# EAGLE design switches annotated (EAGLE 6.5.0)
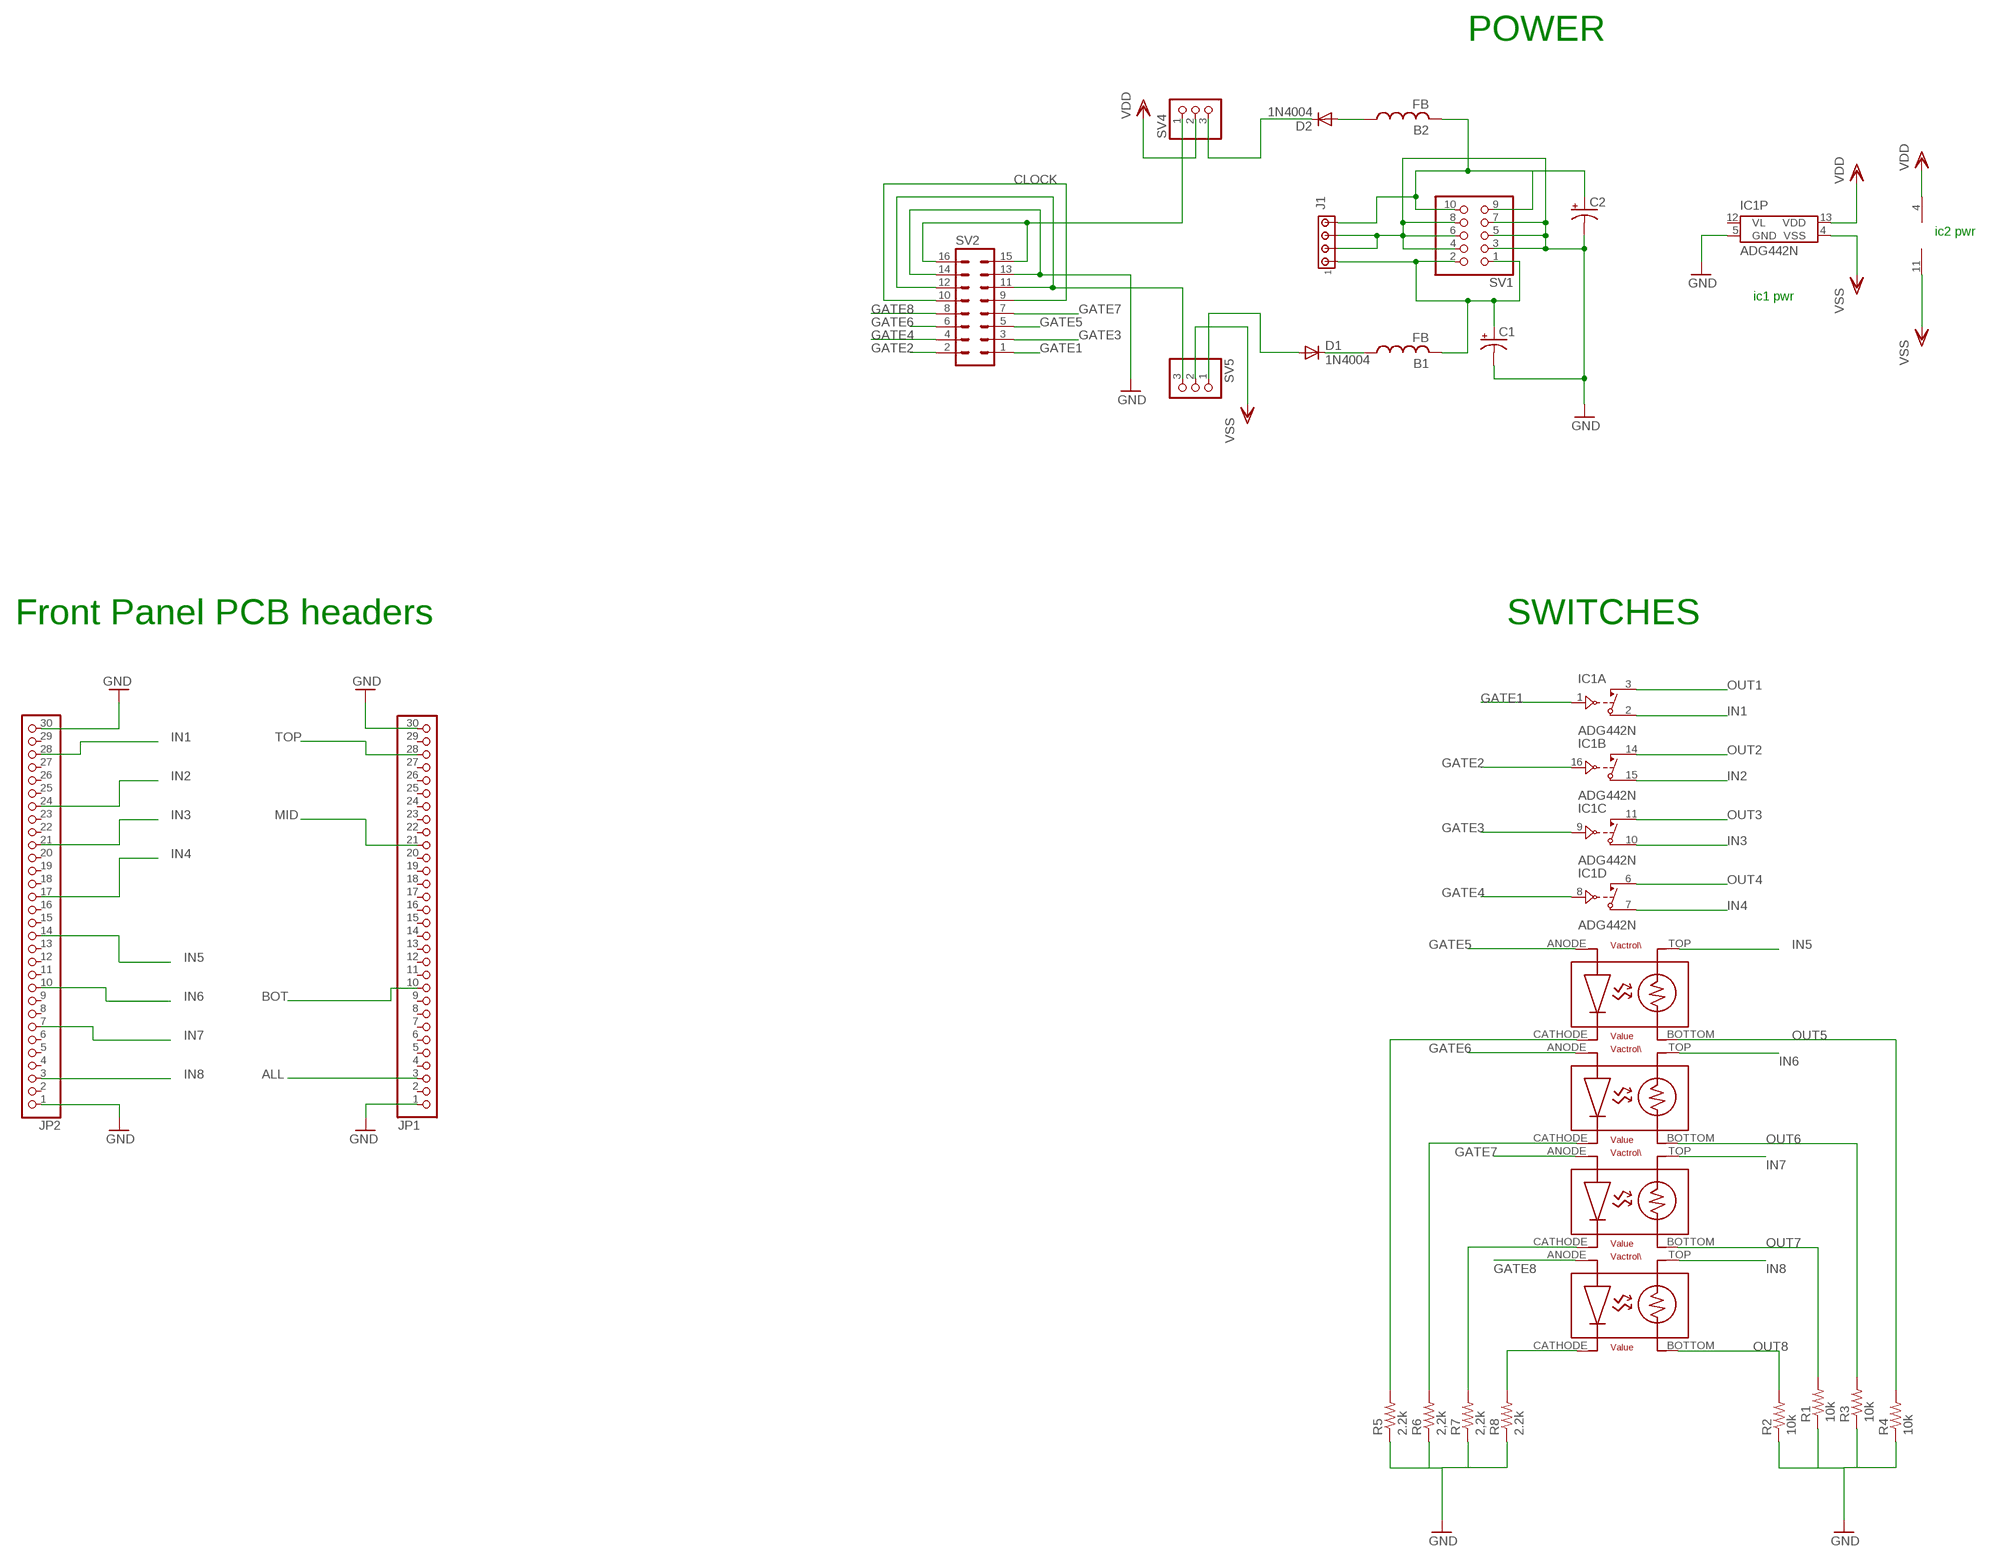
[diagram p0: schematic, sheet 1, part 1 of 2]
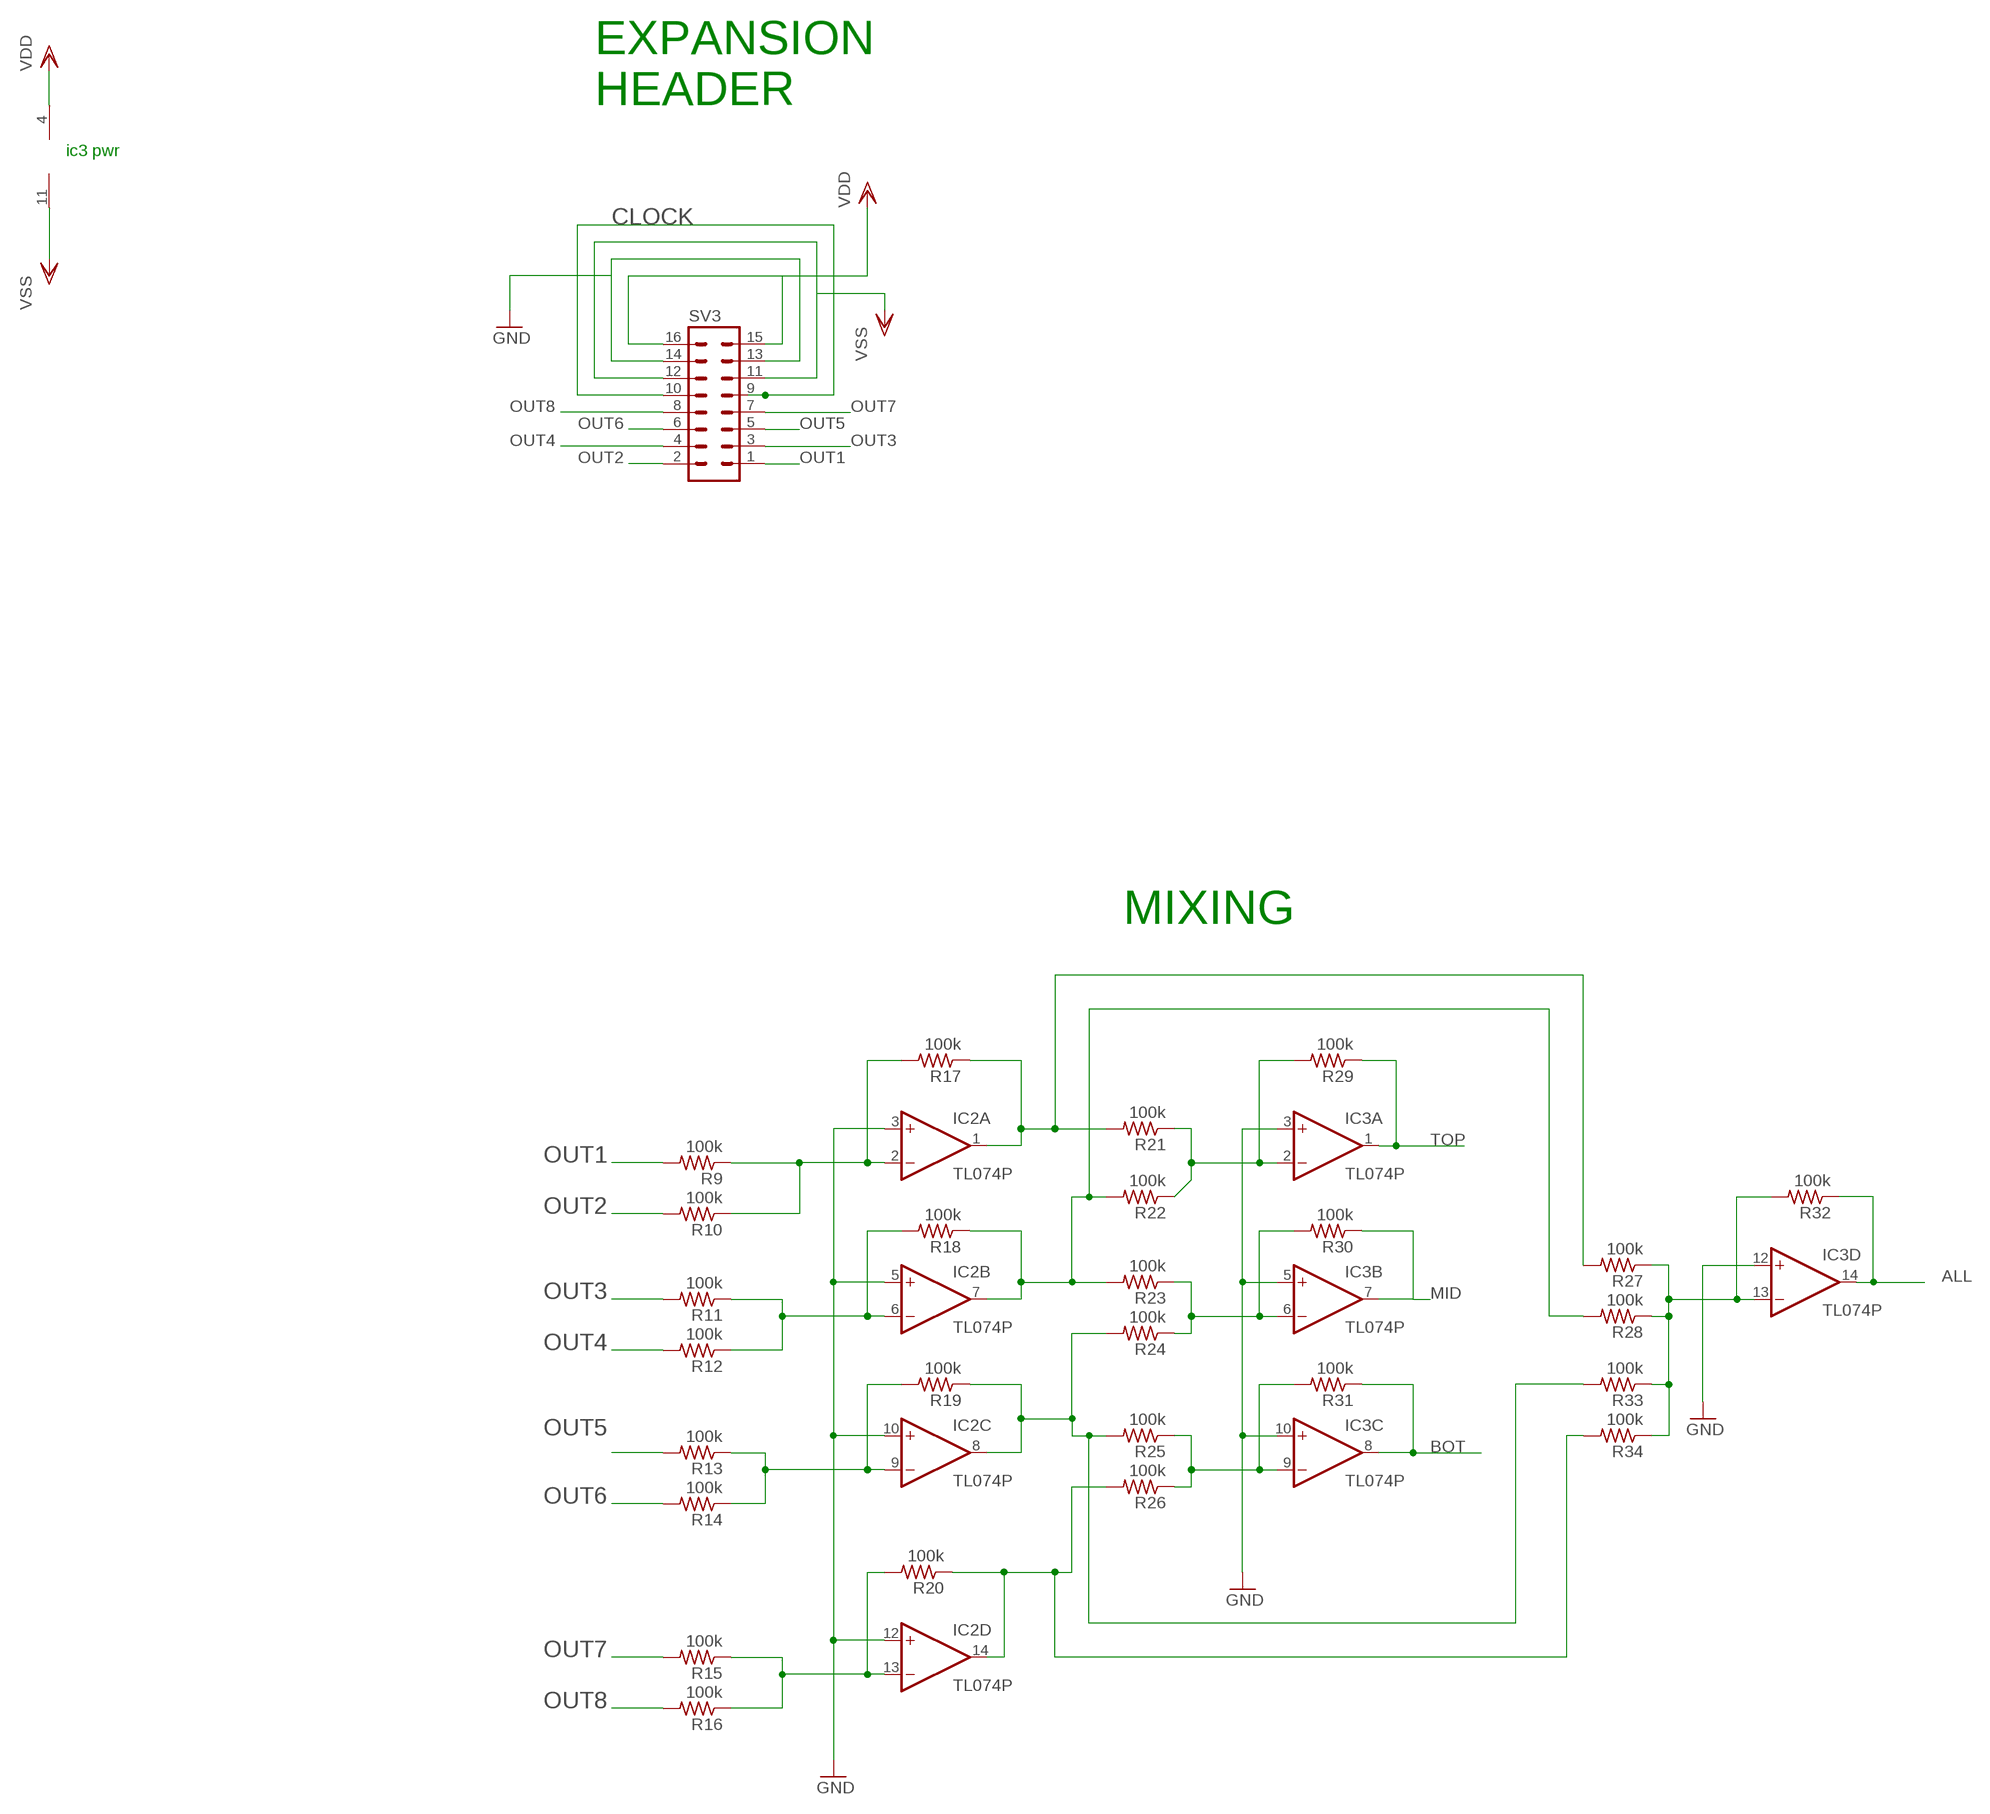
[diagram p1: schematic, sheet 1, part 2 of 2]

## Parts
B1  FB  [FB]
B2  FB  [FB]
C1  CPOL-USE1.8-4  [E1,8-4]
C2  CPOL-USE1.8-4  [E1,8-4]
D1  1N4004  [DO41-10]
D2  1N4004  [DO41-10]
IC1  ADG442N  [DIL16]
IC2  TL074P  [DIL14]
IC3  TL074P  [DIL14]
J1  MTA04-156  [1X4MTA]
JP1  PINHD-1X30  [1X30]
JP2  PINHD-1X30  [1X30]
R1  10k  R-US_0204/2V  [0204V]
R2  10k  R-US_0204/2V  [0204V]
R3  10k  R-US_0204/2V  [0204V]
R4  10k  R-US_0204/2V  [0204V]
R5  2.2k  R-US_0204/2V  [0204V]
R6  2,2k  R-US_0204/2V  [0204V]
R7  2,2k  R-US_0204/2V  [0204V]
R8  2.2k  R-US_0204/2V  [0204V]
R9  100k  R-US_0204/7  [0204/7]
R10  100k  R-US_0204/7  [0204/7]
R11  100k  R-US_0204/7  [0204/7]
R12  100k  R-US_0204/7  [0204/7]
R13  100k  R-US_0204/7  [0204/7]
R14  100k  R-US_0204/7  [0204/7]
R15  100k  R-US_0204/7  [0204/7]
R16  100k  R-US_0204/7  [0204/7]
R17  100k  R-US_0204/2V  [0204V]
R18  100k  R-US_0204/2V  [0204V]
R19  100k  R-US_0204/2V  [0204V]
R20  100k  R-US_0204/2V  [0204V]
R21  100k  R-US_0204/7  [0204/7]
R22  100k  R-US_0204/7  [0204/7]
R23  100k  R-US_0204/7  [0204/7]
R24  100k  R-US_0204/7  [0204/7]
R25  100k  R-US_0204/2V  [0204V]
R26  100k  R-US_0204/7  [0204/7]
R27  100k  R-US_0204/7  [0204/7]
R28  100k  R-US_0204/7  [0204/7]
R29  100k  R-US_0204/2V  [0204V]
R30  100k  R-US_0204/2V  [0204V]
R31  100k  R-US_0204/2V  [0204V]
R32  100k  R-US_0204/2V  [0204V]
R33  100k  R-US_0204/2V  [0204V]
R34  100k  R-US_0204/2V  [0204V]
SV1  PINHD-2X5  [2X05]
SV2  MA08-2  [MA08-2]
SV3  MA08-2  [MA08-2]
SV4  PINHD-1X3  [1X03]
SV5  PINHD-1X3  [1X03]
U$1  VACTROL  [VACTROL]
U$2  VACTROL  [VACTROL]
U$3  VACTROL  [VACTROL]
U$4  VACTROL  [VACTROL]

## Nets
ALL: IC3.14(D:OUT) JP1.3 R32.1
BOT: IC3.8(C:OUT) JP1.10 R31.1
CLOCK: SV2.9 SV2.10 SV3.9 SV3.10
GATE1: IC1.1(A:IN) SV2.1
GATE2: IC1.16(B:IN) SV2.2
GATE3: IC1.9(C:IN) SV2.3
GATE4: IC1.8(D:IN) SV2.4
GATE5: SV2.5 U$1.ANODE
GATE6: SV2.6 U$2.ANODE
GATE7: SV2.7 U$3.ANODE
GATE8: SV2.8 U$4.ANODE
GND: C1.- C2.- IC1.5(P:GND) IC2.3(A:+IN) IC2.5(B:+IN) IC2.10(C:+IN) IC2.12(D:+IN) IC3.3(A:+IN) IC3.5(B:+IN) IC3.10(C:+IN) IC3.12(D:+IN) J1.2 J1.3 JP1.1 JP1.30 JP2.1 JP2.30 R1.1 R2.1 R3.1 R4.1 R5.1 R6.1 R7.1 R8.1 SV1.3 SV1.4 SV1.5 SV1.6 SV1.7 SV1.8 SV2.13 SV2.14 SV3.13 SV3.14
IN1: IC1.2(A:D) JP2.28
IN2: IC1.15(B:D) JP2.24
IN3: IC1.10(C:D) JP2.21
IN4: IC1.7(D:D) JP2.17
IN5: JP2.14 U$1.TOP
IN6: JP2.10 U$2.TOP
IN7: JP2.7 U$3.TOP
IN8: JP2.3 U$4.TOP
MID: IC3.7(B:OUT) JP1.21 R30.1
N$1: R5.2 U$1.CATHODE
N$2: IC2.8(C:OUT) R19.1 R24.2 R25.2 R33.2
N$3: IC2.13(D:-IN) R15.1 R16.1 R20.2
N$4: IC2.14(D:OUT) R20.1 R26.2 R34.2
N$5: IC2.9(C:-IN) R13.1 R14.1 R19.2
N$6: IC2.6(B:-IN) R11.1 R12.1 R18.2
N$7: R8.2 U$4.CATHODE
N$8: R7.2 U$3.CATHODE
N$9: R6.2 U$2.CATHODE
N$10: IC2.2(A:-IN) R9.1 R10.1 R17.2
N$11: IC2.7(B:OUT) R18.1 R22.2 R23.2 R28.2
N$12: IC2.1(A:OUT) R17.1 R21.2 R27.2
N$13: IC3.9(C:-IN) R25.1 R26.1 R31.2
N$14: IC3.6(B:-IN) R23.1 R24.1 R30.2
N$15: IC3.2(A:-IN) R21.1 R22.1 R29.2
N$17: D2.C SV4.3
N$18: B1.P$2 C1.+ J1.1 SV1.1 SV1.2
N$19: SV2.15 SV2.16 SV4.1
N$20: D1.A SV5.1
N$21: SV2.11 SV2.12 SV5.3
N$22: B2.P$1 D2.A
N$23: B1.P$1 D1.C
N$25: B2.P$2 C2.+ J1.4 SV1.9 SV1.10
N$26: IC3.13(D:-IN) R27.1 R28.1 R32.2 R33.1 R34.1
OUT1: IC1.3(A:S) R9.2 SV3.1
OUT2: IC1.14(B:S) R10.2 SV3.2
OUT3: IC1.11(C:S) R11.2 SV3.3
OUT4: IC1.6(D:S) R12.2 SV3.4
OUT5: R4.2 R13.2 SV3.5 U$1.BOTTOM
OUT6: R3.2 R14.2 SV3.6 U$2.BOTTOM
OUT7: R1.2 R15.2 SV3.7 U$3.BOTTOM
OUT8: R2.2 R16.2 SV3.8 U$4.BOTTOM
TOP: IC3.1(A:OUT) JP1.28 R29.1
VDD: IC1.13(P:VDD) IC2.4(P:V+) IC3.4(P:V+) SV3.15 SV3.16 SV4.2
VSS: IC1.4(P:VSS) IC2.11(P:V-) IC3.11(P:V-) SV3.11 SV3.12 SV5.2
Unconnected: JP1.2 JP1.4 JP1.5 JP1.6 JP1.7 JP1.8 JP1.9 JP1.11 JP1.12 JP1.13 JP1.14 JP1.15 JP1.16 JP1.17 JP1.18 JP1.19 JP1.20 JP1.22 JP1.23 JP1.24 JP1.25 JP1.26 JP1.27 JP1.29 JP2.2 JP2.4 JP2.5 JP2.6 JP2.8 JP2.9 JP2.11 JP2.12 JP2.13 JP2.15 JP2.16 JP2.18 JP2.19 JP2.20 JP2.22 JP2.23 JP2.25 JP2.26 JP2.27 JP2.29

## Notes on the sheet
- POWER
- EXPANSION
  HEADER
- ic2 pwr
- ic3 pwr
- ic1 pwr
- Front Panel PCB headers
- SWITCHES
- MIXING

## Power pins joined to a net without a drawn wire
VL: IC1.12(P:VL)

## Library data of the parts
B1 B2 = adafruit:FB: Ferrite bead Digikey #P9821BK-ND
C1 C2 = rcl:CPOL-US: POLARIZED CAPACITOR, American symbol
D1 D2 = diode:1N4004: DIODE general purpose rectifier, 1 A
IC1 = analog-devices:ADG442: LC2MOS Precision Quad SPST Switches Source: http://www.analog.com/static/imported-files/data_sheets/ADG411_412_413.pdf; MF: ALTERA CORPORATION; MPN: ADG411BN; OC_FARNELL: 1424317; OC_NEWARK: 05F6198
IC2 IC3 = linear:TL074: OP AMP
J1 = con-amp:MTA04-156: AMP connector
JP1 JP2 = pinhead:PINHD-1X30: PIN HEADER
R1-R34 = rcl:R-US_: RESISTOR, American symbol
SV1 = pinhead:PINHD-2X5: PIN HEADER
SV2 SV3 = con-lstb:MA08-2: PIN HEADER; OC_FARNELL: unknown; OC_NEWARK: unknown
SV4 SV5 = pinhead:PINHD-1X3: PIN HEADER
U$1-U$4 = elipech_modified:VACTROL

## Board
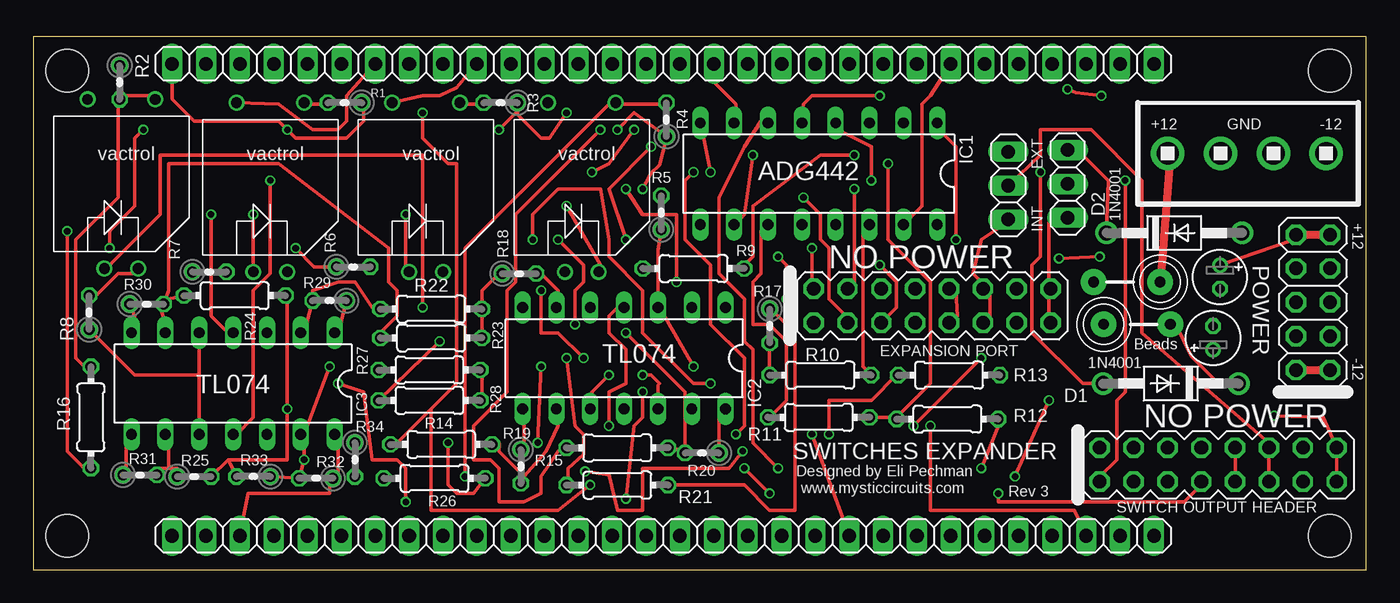
[diagram p2: board, top side]
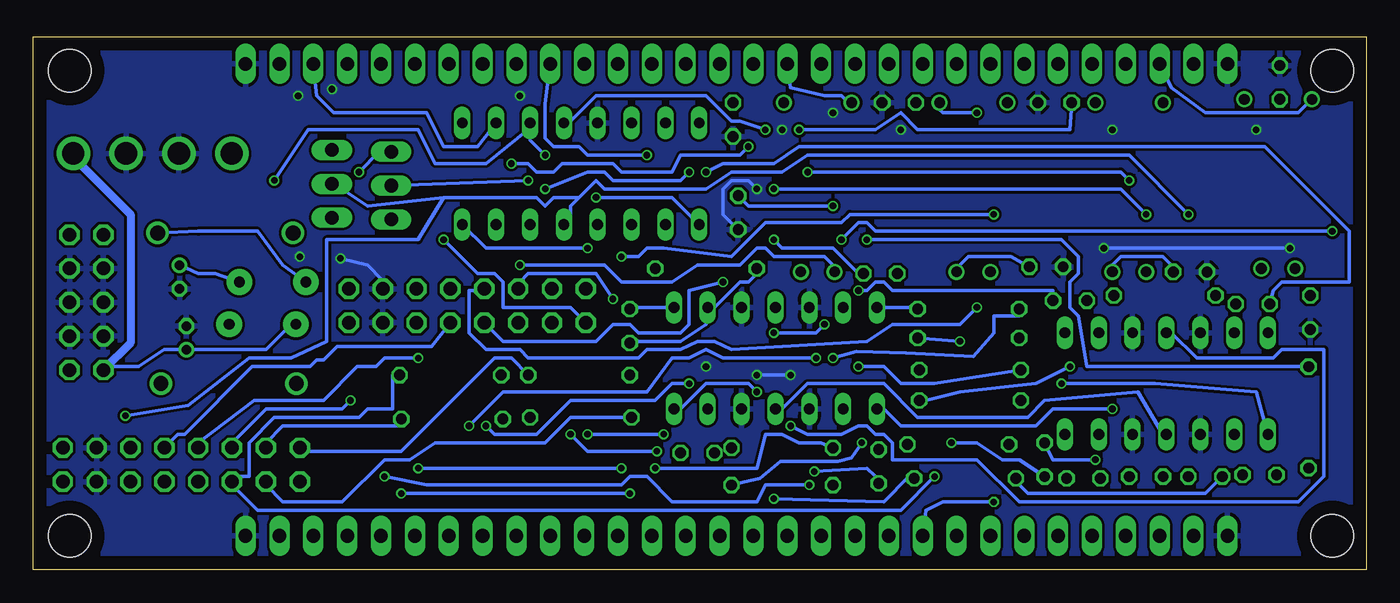
[diagram p3: board, bottom side, seen from below]

Size 100 x 40 mm. Coordinates in mm from the lower left corner, seen from the top.
Outline: 0,0 100,0 100,40 0,40 0,0
Copper layers (1*16): Top 0.035mm / dielectric 1.5mm / Bottom 0.035mm
Design rules "default *": minimum track width 10mil, minimum drill 24mil, track to track 8mil, track to pad 8mil, pad to pad 8mil, via to via 8mil, smd to smd 8mil, copper to edge 40mil, drill to drill 10mil, minimum pad ring 0mil, minimum via ring 0mil, stop-mask expansion 4mil, vias tented up to drill 20mil, thermal gap 10mil
Holes 3.2 mm at 2.54,37.47 2.54,2.54 97.28,2.54 97.28,37.47

### Footprints (pad centres in the part's own frame; a part is rotated, then mirrored left to right if it is on the bottom)
FB = drill 0.8 pad 1.93: P$1 -2.5,0; P$2 2.5,0
E1,8-4 = drill 0.711 pad 1.168: + -0.889,0 | drill 0.711 pad 1.168 octagon: - 0.889,0
DO41-10 = drill 1.118: A 5.08,0; C -5.08,0
DIL16 = drill 0.813 long: 1 -8.89,-3.81; 2 -6.35,-3.81; 3 -3.81,-3.81; 4 -1.27,-3.81; 5 1.27,-3.81; 6 3.81,-3.81; 7 6.35,-3.81; 8 8.89,-3.81; 9 8.89,3.81; 10 6.35,3.81; 11 3.81,3.81; 12 1.27,3.81; 13 -1.27,3.81; 14 -3.81,3.81; 15 -6.35,3.81; 16 -8.89,3.81
DIL14 = drill 0.813 long: 1 -7.62,-3.81; 2 -5.08,-3.81; 3 -2.54,-3.81; 4 0,-3.81; 5 2.54,-3.81; 6 5.08,-3.81; 7 7.62,-3.81; 8 7.62,3.81; 9 5.08,3.81; 10 2.54,3.81; 11 0,3.81; 12 -2.54,3.81; 13 -5.08,3.81; 14 -7.62,3.81
1X4MTA = drill 1.676: 1 5.944,0; 2 1.981,0; 3 -1.981,0; 4 -5.944,0
1X30 = drill 1.016 long: 1 -36.83,0; 2 -34.29,0; 3 -31.75,0; 4 -29.21,0; 5 -26.67,0; 6 -24.13,0; 7 -21.59,0; 8 -19.05,0; 9 -16.51,0; 10 -13.97,0; 11 -11.43,0; 12 -8.89,0; 13 -6.35,0; 14 -3.81,0; 15 -1.27,0; 16 1.27,0; 17 3.81,0; 18 6.35,0; 19 8.89,0; 20 11.43,0; 21 13.97,0; 22 16.51,0; 23 19.05,0; 24 21.59,0; 25 24.13,0; 26 26.67,0; 27 29.21,0; 28 31.75,0; 29 34.29,0; 30 36.83,0
0204V = drill 0.813 octagon: 1 -1.27,0; 2 1.27,0
0204/7 = drill 0.813 octagon: 1 -3.81,0; 2 3.81,0
2X05 = drill 1.016 octagon: 1 -5.08,-1.27; 2 -5.08,1.27; 3 -2.54,-1.27; 4 -2.54,1.27; 5 0,-1.27; 6 0,1.27; 7 2.54,-1.27; 8 2.54,1.27; 9 5.08,-1.27; 10 5.08,1.27
MA08-2 = drill 1.016 octagon: 1 -8.89,-1.27; 2 -8.89,1.27; 3 -6.35,-1.27; 4 -6.35,1.27; 5 -3.81,-1.27; 6 -3.81,1.27; 7 -1.27,-1.27; 8 -1.27,1.27; 9 1.27,-1.27; 10 1.27,1.27; 11 3.81,-1.27; 12 3.81,1.27; 13 6.35,-1.27; 14 6.35,1.27; 15 8.89,-1.27; 16 8.89,1.27
1X03 = drill 1.016 long: 1 -2.54,0; 2 0,0; 3 2.54,0
VACTROL = drill 0.8: ANODE -6.35,1.27; BOTTOM 6.35,-2.54; CATHODE -6.35,-1.27; TOP 6.35,2.54

### Placement (x,y rotation side)
B1  82.8,18.41 180 top
B2  82.04,21.59 0 top
C1  88.52,17.4 90 top
C2  89.03,21.97 270 top
D1  85.34,13.97 180 top
D2  85.6,25.27 0 top
IC1  58.93,29.72 180 top
IC2  44.32,15.88 180 top
IC3  14.99,13.97 180 top
J1  91.06,31.24 0 top
JP1  47.24,2.54 0 top
JP2  47.24,37.97 0 top
R1  23.37,35.05 180 top
R2  6.48,36.58 270 top
R3  35.05,35.05 180 top
R4  47.5,33.78 90 top
R5  47.12,26.8 90 top
R6  24,22.73 0 top
R7  13.21,22.35 0 top
R8  4.19,19.3 90 top
R9  49.53,22.61 0 top
R10  59.05,14.61 0 top
R11  58.93,11.43 180 top
R12  68.58,11.3 0 top
R13  68.71,14.61 0 top
R14  30.61,9.4 180 top
R15  43.81,9.14 180 top
R16  4.32,11.43 90 top
R17  55.24,18.29 270 top
R18  36.45,22.23 0 top
R19  36.58,7.75 270 top
R20  50.16,8.76 180 top
R21  43.81,6.35 0 top
R22  29.84,19.56 0 top
R23  29.84,17.4 0 top
R24  15.11,20.57 0 top
R25  12.06,6.99 0 top
R26  30.1,6.86 0 top
R27  29.72,14.99 180 top
R28  29.72,12.7 180 top
R29  22.23,20.19 180 top
R30  8.51,19.94 0 top
R31  8,7.11 0 top
R32  21.21,6.86 180 top
R33  16.51,6.99 180 top
R34  24.13,8.26 270 top
SV1  96.01,20.07 90 top
SV2  67.44,19.81 0 top
SV3  88.9,7.87 0 top
SV4  77.6,28.96 90 top
SV5  73.15,28.83 270 top
U$1  41.15,28.7 90 top
U$2  29.46,28.7 90 top
U$3  17.78,28.7 90 top
U$4  6.6,28.96 90 top

### Tracks (layer width: path | path; a pad name or v marks a point on that pad's centre or on a via)
ALL
  Top 0.254: IC3.14 22.86,10.16 22.86,6.99 R32.1 22.23,6.35 22.23,5.71 16.13,5.71 JP1.3
BOT  (via drill 0.5)
  Top 0.254: R31.1 6.99,7.62 6.99,10.16 IC3.8 | v27.94,5.08 27.94,7.62 27.3,8.26 25.4,8.26 24.77,13.34 v22.86,13.97
  Bottom 0.254: v27.94,5.08 31.75,5.08 33.02,4.45 JP1.10 | v22.86,13.97 15.88,13.97 8.26,13.34 IC3.8
CLOCK
  Top 0.254: SV2.10 69.22,20.95 69.34,19.05 SV2.9 | SV3.9 SV3.10
  Bottom 0.254: SV3.10 89.15,10.16 88.65,10.16 83.57,15.24 79.25,15.24 78.74,15.75 78.23,15.75 77.22,16.76 70.1,16.76 SV2.9
GATE1  (via drill 0.5)
  Top 0.254: v69.22,24.77 69.22,31.75 67.94,33.02 IC1.1
  Bottom 0.254: v69.22,24.77 66.67,22.23 65.41,22.23 64.77,21.59 64.77,19.68 59.69,19.68 SV2.1
GATE2  (via drill 0.5)
  Top 0.254: v58.42,24.13 58.42,21.59 SV2.2
  Bottom 0.254: IC1.16 66.04,24.13 v58.42,24.13
GATE3  (via drill 0.5)
  Top 0.254: v57.78,27.94 59.05,26.67 59.05,24.77 59.69,24.13 59.69,20.32 60.96,19.05 SV2.3
  Bottom 0.254: IC1.9 52.07,27.94 v57.78,27.94
GATE4  (via drill 0.5)
  Top 0.254: v50.8,29.84 50.16,33.02 IC1.8 | v61.59,28.57 61.59,21.59 SV2.4
  Bottom 0.254: v50.8,29.84 51.44,29.21 56.52,29.21 57.15,29.84 58.42,29.84 v61.59,28.57
GATE5  (via drill 0.5)
  Top 0.254: v63.5,22.86 64.77,21.59 64.77,19.68 SV2.5
  Bottom 0.254: v63.5,22.86 57.15,22.86 55.88,21.59 52.07,21.59 50.16,22.86 46.99,22.86 45.72,24.13 45.09,24.13 44.45,23.5 40.64,23.5 40.01,22.86 U$1.ANODE
GATE6  (via drill 0.5)
  Top 0.254: v27.94,26.67 27.94,22.86 U$2.ANODE | v55.88,23.5 56.52,22.86 v56.52,20.32
  Bottom 0.254: v27.94,26.67 38.73,26.67 39.37,26.04 45.09,26.04 47.62,23.5 52.7,24.13 53.98,24.13 54.61,23.5 v55.88,23.5 | v56.52,20.32 57.78,22.23 62.87,22.23 63.5,21.59 SV2.6
GATE7  (via drill 0.5)
  Top 0.254: v16.51,26.67 U$3.ANODE | v48.26,21.59 48.26,26.67 45.72,26.67 v44.45,28.57
  Bottom 0.254: v16.51,26.67 18.41,28.57 v44.45,28.57 | v48.26,21.59 50.8,20.95 50.8,18.41 51.44,17.78 54.61,17.78 55.24,18.41 56.52,18.41 57.78,17.14 64.77,17.14 SV2.7
GATE8  (via drill 0.5)
  Top 0.254: v29.21,19.68 29.21,31.11 9.53,31.11 9.53,26.67 5.71,22.86 U$4.ANODE
  Bottom 0.254: v29.21,19.68 30.48,18.41 35.56,18.41 37.47,17.14 47.62,16.51 48.9,17.14 50.16,17.14 51.44,16.51 53.98,16.51 54.61,15.88 62.87,15.88 63.5,16.51 66.04,16.51 67.31,17.78 67.31,20.95 66.67,20.95 SV2.8
GND  (via drill 0.5)
  Top 0.254: v40.01,34.29 38.73,32.38 38.1,32.38 36.32,34.16 R3.1 36.32,34.42 v34.92,33.02 | v43.81,33.02 45.09,34.29 R4.1 47.5,32.39 46.97,30.38 46.35,29.76 v45.72,28.57 | IC2.12 46.86,13.84 46.99,13.97 46.35,14.61 v45.72,14.61 | v43.18,14.61 41.91,13.34 41.91,12.19 IC2.10 | JP2.1 10.41,35.31 12.06,33.66 18.41,33.66 v19.05,33.02 19.68,32.38 23.5,32.38 24.77,33.66 24.77,34.92 R1.1 | v49.53,15.24 46.99,19.68 IC2.3 46.86,24 R5.1 | v76.96,23.37 v80.01,23.5 | IC1.5 57.66,34.16 57.78,34.92 58.42,35.56 v63.5,35.56 | v77.6,36.07 78.23,35.81 v80.14,35.56 | R6.1 21.08,22.73 v19.68,24.13 | v5.71,24.13 5.71,25.4 7.62,27.3 7.62,32.38 v8.26,33.02 | IC3.5 12.45,14.61 | 12.45,14.61 IC3.10 | R8.1 7.62,14.61 12.45,14.61
  Bottom 0.254: v45.72,14.61 v43.18,14.61 | SV2.14 73.79,21.72 74.93,22.86 v76.96,23.37 | v19.68,24.13 v5.71,24.13 | R5.1 48.26,26.67 48.26,28.57 47.62,29.21 46.35,29.21 v45.72,28.57
  pour Bottom: 0,-2.54 -2.54,-2.54 -2.54,43.18 101.6,43.18 101.6,-2.54
IN1
  Bottom 0.254: IC1.2 66.67,31.75 69.22,31.75 70.48,34.29 77.47,34.29 78.74,35.56 JP2.28
IN2
  Top 0.254: IC1.15 66.67,27.3 66.67,34.92 67.31,35.56 JP2.24
IN3  (via drill 0.5)
  Top 0.254: IC1.10 53.34,26.67 v53.98,31.11
  Bottom 0.254: v53.98,31.11 58.42,31.11 59.05,31.75 60.96,31.75 61.59,32.38 61.59,34.92 JP2.21
IN4
  Top 0.254: JP2.17 51.05,36.58 52.7,34.92 52.7,33.66 IC1.7
IN5
  Bottom 0.254: U$1.TOP 38.86,35.05 39.37,35.56 40.64,35.56 43.18,36.2 JP2.14
IN6
  Top 0.254: U$2.TOP 29.21,35.56 30.48,35.56 31.75,36.2 JP2.10
IN7
  Top 0.254: U$3.TOP 18.41,34.92 20.95,33.02 22.86,33.02 23.5,33.66 23.5,35.56 JP2.7
IN8
  Bottom 0.254: U$4.TOP 5.08,34.29 12.06,34.29 14.61,36.2 JP2.3
MID  (via drill 0.5)
  Top 0.254: IC3.7 7.62,17.78 7.62,19.05 R30.1 | v52.7,10.16 53.34,10.79 53.34,15.88 50.8,18.41 50.8,22.86 48.9,24.77 48.9,29.21 v49.53,29.84 | JP1.21 v58.42,10.16
  Bottom 0.254: v52.7,10.16 v58.42,10.16 | v49.53,29.84 48.26,30.48 44.45,30.48 42.55,31.75 7.62,31.75 1.27,25.4 1.27,21.59 6.35,21.59 6.99,20.95 R30.1
N$1  (via drill 0.5)
  Top 0.254: v40.01,27.3 42.55,22.86 U$1.CATHODE
  Bottom 0.254: v40.01,27.3 46.35,27.3 R5.2
N$2  (via drill 0.5)
  Top 0.254: R19.1 36.83,9.53 36.83,12.06 IC2.8 | 14.61,8.26 19.05,8.26 v19.05,12.06 19.05,20.32 R24.2 | 14.61,8.26 R25.2 | 14.61,8.26 R33.2
  Bottom 0.254: v19.05,12.06 23.5,12.06 24.77,10.79 34.92,10.79 36.2,12.06 IC2.8
N$3  (via drill 0.5)
  Top 0.254: 48.9,9.02 48.01,9.02 R15.1 | v2.54,25.4 2.54,8.89 3.81,7.62 R16.1 | v39.37,24.77 41.27,22.86 41.27,21.59 40.64,20.95 v40.64,18.41 | v44.45,17.78 48.9,13.34 48.9,12.06 | 48.9,12.06 48.9,9.02 | 48.9,9.02 R20.2 | 48.9,12.06 IC2.13
  Bottom 0.254: v2.54,25.4 36.83,25.4 37.47,26.04 38.1,26.04 v39.37,24.77 | v40.64,18.41 41.27,17.78 v44.45,17.78
N$4  (via drill 0.5)
  Top 0.254: v44.45,5.33 45.09,10.79 45.72,11.43 v45.72,13.34 | R20.1 51.44,12.06 IC2.14 | v31.11,9.53 31.11,6.35 31.75,5.71 33.02,5.71 R26.2
  Bottom 0.254: v44.45,5.33 36.2,5.08 34.29,6.99 R26.2 | v45.72,13.34 46.35,13.97 49.53,13.97 51.44,12.06 IC2.14 | R34.2 26.04,8.26 27.3,8.26 29.21,9.53 v31.11,9.53
N$5  (via drill 0.5)
  Top 0.254: 36.83,6.99 34.92,8.89 34.92,9.53 R14.1 | 36.83,6.99 38.48,8.89 39.37,10.79 IC2.9 | 36.83,6.99 R19.2 | v59.69,10.16 59.69,12.7 62.87,12.7 64.77,14.61 R13.1 | v53.21,8.89 52.2,7.62 45.72,7.62 45.72,4.45 43.81,4.45 43.18,7.11 v41.4,7.37
  Bottom 0.254: v59.69,10.16 58.42,8.89 v53.21,8.89 | v41.4,7.37 37.47,7.62 36.83,6.99 R19.2
N$6  (via drill 0.5)
  Top 0.254: R11.1 64.77,11.43 | R18.2 38.1,22.23 39.37,20.95 39.37,19.68 IC2.6 | 64.77,11.43 67.31,13.97 67.31,21.59 64.14,24.77 v64.14,30.48 | v46.35,31.75 43.18,28.57 v44.45,24.77 | 64.77,11.43 R12.1
  Bottom 0.254: v64.14,30.48 62.87,30.48 62.23,29.84 60.96,29.84 60.33,30.48 56.52,30.48 55.88,29.84 52.07,29.84 51.44,31.11 46.99,31.11 v46.35,31.75 | v44.45,24.77 43.81,24.13 40.01,24.13 38.1,22.23 R18.2
N$7
  Top 0.254: U$4.CATHODE 7.62,22.23 6.35,22.23 4.45,20.32 R8.2
N$8
  Bottom 0.254: U$3.CATHODE 19.05,22.86 18.41,23.5 15.24,23.5 14.61,22.86 R7.2
N$9
  Bottom 0.254: R6.2 26.67,23.5 29.84,23.5 30.48,22.86 U$2.CATHODE
N$10
  Top 0.254: R17.2 R10.1
  Bottom 0.254: R9.1 45.72,22.23 46.35,21.59 46.99,21.59 48.9,19.68 IC2.2 49.53,19.68 49.53,18.41 51.44,17.14 55.24,17.14 R17.2
N$11  (via drill 0.5)
  Top 0.254: R23.2 R22.2 33.66,20.95 34.92,22.23 R18.1 | R28.2 v30.48,17.14
  Bottom 0.254: IC2.7 33.66,19.68 R22.2 | v30.48,17.14 R23.2
N$12  (via drill 0.5)
  Top 0.254: R21.2 53.34,6.35 55.24,4.45 57.15,4.45 57.15,17.78 55.24,19.68 R17.1 | v38.1,15.24 v37.85,9.53
  Bottom 0.254: IC2.1 55.24,19.68 R17.1 | R27.2 32.38,13.97 34.92,13.97 36.2,15.24 v38.1,15.24 | v37.85,9.53 38.61,8.38 39.62,8.13 43.94,8.13 45.47,6.86 R21.2
N$13
  Top 0.254: 10.16,7.62 10.79,7.62 R25.1 | 10.16,7.62 9.53,7.62 R31.2 | 10.16,7.62 10.16,10.16 IC3.9
  Bottom 0.254: R25.1 12.06,5.71 25.4,5.71 26.04,6.35 R26.1
N$14
  Top 0.254: IC3.6 10.16,17.78 9.53,19.68 R30.2 | R30.2 10.16,20.32 R24.1 | R23.1 26.04,17.78 27.3,19.05 27.3,20.95 26.67,21.59 26.67,24.13 18.41,30.48 10.16,30.48 10.16,20.95 R30.2
N$15  (via drill 0.5)
  Top 0.254: IC3.2 20.32,17.78 R29.2 20.95,20.95 22.86,21.59 24.13,21.59 25.4,19.68 R22.1 | v40.01,15.88 40.64,10.79 41.27,10.16 41.27,8.64 40.13,7.62 40.13,6.35 R21.1
  Bottom 0.254: v40.01,15.88 38.23,16.38 34.54,16.26 29.46,16 27.94,17.78 27.94,19.05 26.04,19.05 R22.1
N$17
  Top 0.254: SV4.3 78.11,31.75 80.64,29.21 D2.C
N$18
  Top 0.61: SV1.2 SV1.1
  Bottom 0.254: C1.+ 90.17,16.51 92.08,15.24 94.61,15.24 SV1.2 | C1.+ 82.55,16.51 80.64,18.41 B1.P$2 | 89.53,16.51 C1.+
  Bottom 0.61: J1.1 97,30.96 92.71,26.67 92.71,17.02 SV1.2
N$19
  Top 0.254: SV2.15 76.2,19.05 76.2,20.95 SV2.16 76.2,21.59 76.2,26.04 SV4.1
N$20  (via drill 0.5 pad 0.25)
  Top 0.254: v75.56,29.84 75.56,23.5 74.93,22.86 74.93,17.78 78.74,13.97 D1.A
  Bottom 0.254: SV5.1 74.04,31.37 v75.56,29.84
N$21
  Top 0.254: SV2.11 71.75,19.05 71.75,20.95 SV2.12 71.12,21.59 70.48,22.23 71.12,24.77 73.03,26.04 SV5.3
N$22
  Bottom 0.254: D2.A 87.63,25.4 83.19,25.4 81.28,22.86 B2.P$1
N$23
  Top 0.254: D1.C 88.9,13.97 86.87,16 85.72,18.41 B1.P$1
N$25
  Top 0.254: C2.+ 94.61,24.77 SV1.10
  Top 0.61: J1.4 85.3,31.24 B2.P$2 | SV1.10 SV1.9
  Bottom 0.254: C2.+ 87.63,22.23 86.36,22.23 B2.P$2
N$26  (via drill 0.5)
  Top 0.254: R28.1 33.66,12.7 33.66,14.61 R27.1 | 20.32,10.16 v20.32,8.26 R32.2 R33.1 | 20.32,10.16 v22.23,15.24 | 20.32,10.16 IC3.13
  Bottom 0.254: v22.23,15.24 24.77,13.97 30.48,13.34 33.02,12.7 R28.1 | v20.32,8.26 23.5,8.26 R34.1
OUT1  (via drill 0.5)
  Top 0.254: R9.2 53.34,22.86 53.98,23.5 53.98,27.3 59.05,31.11 v61.59,31.11 | v81.92,29.21 81.92,13.34 81.28,12.7 81.28,8.26 80.01,6.99 SV3.1
  Bottom 0.254: v81.92,29.21 79.38,33.02 71.12,33.02 69.85,30.48 66.04,30.48 62.87,33.02 IC1.3 62.74,32.26 v61.59,31.11
OUT2
  Top 0.254: R10.2 62.23,15.24 62.23,25.4 IC1.14
  Bottom 0.254: R10.2 64.14,15.88 65.41,15.88 72.39,8.89 80.01,8.89 SV3.2
OUT3
  Top 0.254: R11.2 55.24,11.43 56.52,12.7 56.52,17.14 55.24,18.41 53.98,18.41 53.98,21.59 54.61,22.23 54.61,25.4 IC1.11
  Bottom 0.254: R11.2 59.69,11.43 61.59,9.53 69.85,9.53 71.75,8.26 73.66,8.26 76.83,5.08 81.28,5.08 82.55,6.35 SV3.3
OUT4  (via drill 0.5)
  Top 0.254: v55.88,7.62 53.98,9.53 53.98,16.51 53.34,17.14 53.34,20.32 51.44,22.23 51.44,27.94 53.34,31.75 54.61,33.66 IC1.6 | v71.12,7.62 72.39,10.79 R12.2
  Bottom 0.254: v71.12,7.62 v55.88,7.62 | SV3.4 82.55,9.53 81.28,10.79 72.39,10.79 R12.2
OUT5  (via drill 0.5)
  Top 0.254: R4.2 46.99,34.92 43.81,34.92 U$1.BOTTOM 43.18,34.92 32.38,24.13 v32.38,6.99
  Bottom 0.254: R13.2 73.03,14.61 73.03,12.06 74.93,12.06 75.56,11.43 81.92,11.43 83.82,9.53 83.82,6.99 85.09,6.99 SV3.5 85.09,6.35 83.19,4.45 34.92,4.45 v32.38,6.99
OUT6  (via drill 0.5)
  Top 0.254: U$2.BOTTOM 32.38,34.92 33.66,34.92 R3.2 | 29.84,12.06 31.75,13.97 31.75,30.48 31.11,30.48 29.21,32.38 v29.21,34.29 | 29.84,12.06 27.3,9.53 R14.2 | v73.66,6.99 v76.2,12.7 | v41.78,6.35 39.37,4.45 29.84,4.45 29.84,12.06
  Bottom 0.254: v76.2,12.7 76.83,12.06 82.55,12.06 85.09,9.53 SV3.6 | v73.66,6.99 70.48,6.35 55.88,6.35 55.24,6.99 53.98,6.99 52.07,5.08 45.72,5.08 45.09,6.35 v41.78,6.35 | U$2.BOTTOM 32,34.54 31.75,34.29 v29.21,34.29
OUT7  (via drill 0.5)
  Top 0.254: U$3.BOTTOM 20.32,34.92 21.59,34.92 R1.2 | v42.55,33.02 36.2,26.67 36.2,21.59 35.56,20.95 35.56,13.34 33.02,10.79 33.02,8.26 34.29,8.26 34.92,7.62 34.92,5.08 36.83,5.08 38.1,5.71 38.1,6.99 39.37,8.89 R15.2 | v72.39,5.71 72.39,5.08 86.36,5.08 87.63,6.35 SV3.7 | v53.34,7.62 v55.24,5.71
  Bottom 0.254: v42.55,33.02 36.83,33.02 34.92,34.29 33.66,33.02 22.23,33.02 R1.2 | v55.24,5.71 v72.39,5.71 | v53.34,7.62 45.72,7.62 45.09,10.16 43.81,10.16 42.55,9.53 40.89,9.53 R15.2
OUT8  (via drill 0.5)
  Top 0.254: U$4.BOTTOM 8.89,35.56 6.99,35.56 R2.2 6.35,34.92 6.35,27.94 3.17,24.77 3.17,15.88 3.81,15.24 R16.2 | v66.04,10.79 v71.12,15.88 | v50.8,13.97 49.53,13.97 45.72,17.78 45.72,20.95 43.18,23.5 43.18,24.77 42.55,28.57 39.37,28.57 37.47,26.67 v37.47,24.77
  Bottom 0.254: v71.12,15.88 73.66,15.88 74.3,15.24 75.69,15.24 78.23,12.7 83.44,12.7 87.63,9.53 SV3.8 | v66.04,10.79 65.41,10.16 62.23,10.16 59.69,12.7 53.34,12.7 52.07,13.97 v50.8,13.97 | v37.47,24.77 22.86,24.77 21.59,23.5 21.59,22.23 22.23,21.59 22.23,19.68 21.59,19.05 20.95,15.24 R16.2
TOP  (via drill 0.5)
  Top 0.254: R29.1 22.86,17.78 IC3.1 | v67.31,10.79 67.31,4.45 78.11,4.45 JP1.28 | v41.27,15.88 39.37,17.78 38.1,17.78 v38.1,20.95
  Bottom 0.254: v67.31,10.79 64.77,13.34 53.98,13.34 52.07,15.88 50.8,15.88 49.53,16.51 48.26,15.88 v41.27,15.88 | v38.1,20.95 37.47,20.95 36.83,21.59 36.2,21.59 35.56,20.95 23.5,20.95 R29.1
VDD  (via drill 0.5)
  Top 0.254: v13.34,26.67 13.34,19.05 14.61,17.78 IC3.4 | v43.18,10.79 43.18,13.34 44.45,13.97 44.45,16.51 43.18,17.78 43.18,19.05 43.81,19.68 IC2.4 | SV3.15 SV3.16 96.77,11.43 v93.09,11.56
  Bottom 0.254: v13.34,26.67 17.78,31.11 41.91,31.11 43.81,29.84 47.62,29.84 49.53,28.57 57.15,28.57 57.78,29.21 59.05,27.94 | 59.05,27.94 59.69,27.3 59.69,26.04 IC1.13 | v43.18,10.79 41.91,10.16 39.37,10.16 38.1,10.79 37.47,10.79 36.83,10.16 36.2,10.16 35.56,9.53 35.56,8.26 29.21,8.26 26.04,5.08 5.08,5.08 3.17,6.99 3.17,16.51 6.35,16.51 6.99,15.88 12.7,15.88 14.61,17.78 IC3.4 | 59.05,27.94 60.96,27.94 61.59,27.3 62.23,27.94 69.22,27.94 | 69.22,27.94 74.93,27.3 76.83,28.57 SV4.2 | 69.22,27.94 71.12,24.77 77.98,24.77 77.98,17.14 80.64,15.88 83.82,15.88 88.39,12.32 v93.09,11.56
VSS  (via drill 0.5)
  Top 0.254: SV3.11 SV3.12 92.71,9.53 83.19,17.78 83.19,29.21 79.38,33.02 75.56,33.02 75.56,31.11 SV5.2 | v62.87,29.21 62.87,31.75 60.33,33.02 IC1.4 | v17.78,29.21 17.78,22.23 16.51,20.95 16.51,11.43 15.24,10.16 IC3.11 | v45.09,33.02 43.18,30.48 v41.91,29.84
  Bottom 0.254: IC3.11 15.24,10.16 17.14,13.34 24.13,12.7 25.4,11.43 33.66,11.43 36.2,13.97 41.91,13.97 43.81,12.06 IC2.11 | SV5.2 v62.87,29.21 | v17.78,29.21 18.41,29.84 v41.91,29.84 | v45.09,33.02 46.99,33.66 47.62,33.66 49.53,35.56 57.78,35.56 59.69,33.66 IC1.4

### Text on the board
tPlace: +12 | GND | -12 | vactrol | vactrol | vactrol | vactrol | 1N4001 | ADG442 | +12 | Beads | EXPANSION PORT | -12 | TL074 | 1N4001 | TL074 | SWITCHES EXPANDER | Designed by Eli Pechman | www.mysticcircuits.com | Rev 3 | SWITCH OUTPUT HEADER
tNames: EXT | INT | NO POWER | POWER | NO POWER
tValues: Power Select | -12 | +12